# Altium schematic sheet usb2ttl.SchDoc
size A4; SheetNumber: 1; SheetTotal: 1
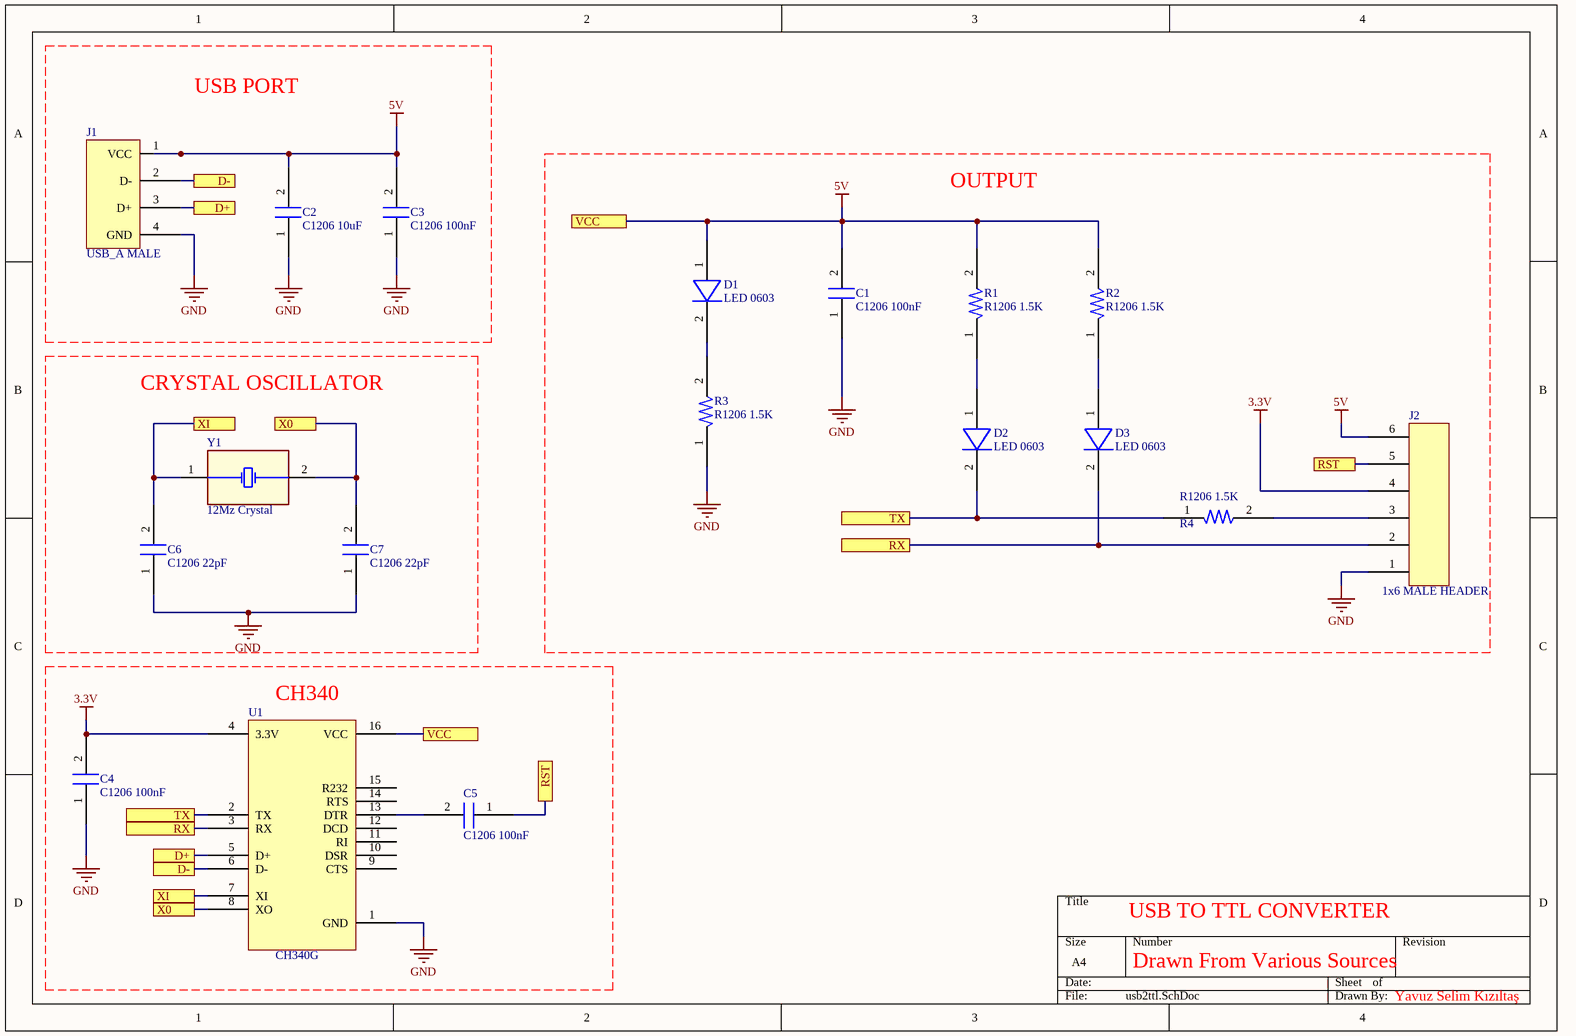
[diagram p0: usb2ttl.SchDoc]

## Parts
C1  C1206 100nF  [C1206]
C2  C1206 10uF  [C1206]
C3  C1206 100nF  [C1206]
C4  C1206 100nF  [C1206]
C5  C1206 100nF  [C1206]
C6  C1206 22pF  [C1206]
C7  C1206 22pF  [C1206]
D1  LED 0603  [LED 0603]
D2  LED 0603  [LED 0603]
D3  LED 0603  [LED 0603]
J1  USB_A MALE  [USBA_MALE]
J2  1x6 MALE HEADER  [1x6 MALE HEADER]
R1  R1206 1.5K  [R1206]
R2  R1206 1.5K  [R1206]
R3  R1206 1.5K  [R1206]
R4  R1206 1.5K  [R1206]
U1  CH340G  [CH340G]
Y1  12Mz Crystal  [12MHz Crystal]

## Ports
D+, D-, RST, RX, TX, VCC, X0, XI

## Nets
3.3V: C4.2 J2.4 U1.4(3.3V)
5V: C1.2 C2.2 C3.2 D1.1 J1.1(VCC) J2.6 R1.2 R2.2 U1.16(VCC) ; port VCC
GND: C1.1 C2.1 C3.1 C4.1 C6.1 C7.1 J1.4(GND) J2.1 R3.1 U1.1(GND)
D+: J1.3(D+) U1.5(D+) ; port D+
D-: J1.2(D-) U1.6(D-) ; port D-
RST: C5.1 J2.5 ; port RST
RX: D3.2 J2.2 U1.3(RX) ; port RX
TX: D2.2 R4.1 U1.2(TX) ; port TX
X0: C7.2 U1.8(XO) Y1.2 ; port X0
XI: C6.2 U1.7(XI) Y1.1 ; port XI
NetC5_2: C5.2 U1.13(DTR)
NetD1_2: D1.2 R3.2
NetD2_1: D2.1 R1.1
NetD3_1: D3.1 R2.1
NetJ2_3: J2.3 R4.2

Not connected (* = marked no-connect by the designer): U1 9(CTS) 10(DSR) 11(RI) 12(DCD) 14(RTS) 15(R232)

## Notes on the sheet
- USB PORT
- OUTPUT
- CRYSTAL OSCILLATOR
- (near U1) CH340
- USB TO TTL CONVERTER
- Drawn From Various Sources
- Yavuz Selim Kızıltaş